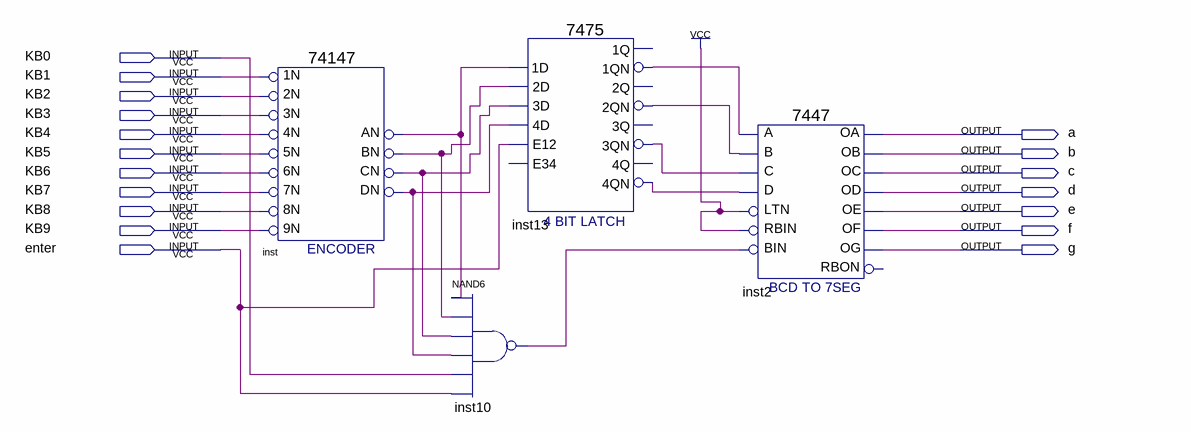
[diagram p0: schematic sheet]
// Quartus schematic circuitosSecuritybox2.bdf as structural Verilog: 4 symbols, 18 pins
module circuitosSecuritybox2 (
  input  KB0,
  input  KB1,
  input  KB2,
  input  KB3,
  input  KB4,
  input  KB5,
  input  KB6,
  input  KB7,
  input  KB8,
  input  KB9,
  input  enter,
  output a,
  output b,
  output c,
  output d,
  output e,
  output f,
  output g
);

  wire inst10_out, inst13_1qn, inst13_2qn, inst13_3qn, inst13_4qn, inst_an, inst_bn, inst_cn, inst_dn;

  \74147  inst (
    .\1N (KB1), .\2N (KB2), .\3N (KB3), .\6N (KB6), .\5N (KB5), .\4N (KB4), .\9N (KB9), .\8N (KB8),
    .\7N (KB7), .CN(inst_cn), .BN(inst_bn), .AN(inst_an), .DN(inst_dn));
  nand inst10 (inst10_out, inst_an, inst_bn, inst_cn, inst_dn, KB0, enter);
  \7475  inst13 (
    .E12(enter), .\3D (inst_cn), .\4D (inst_dn), .\2D (inst_bn), .\1D (inst_an), .\1QN (inst13_1qn),
    .\3QN (inst13_3qn), .\4QN (inst13_4qn), .\2QN (inst13_2qn));  // open: E34, 1Q, 2Q, 3Q, 4Q
  \7447  inst2 (
    .LTN(1'b1), .B(inst13_2qn), .C(inst13_3qn), .D(inst13_4qn), .RBIN(1'b1), .BIN(inst10_out),
    .A(inst13_1qn), .OB(b), .OC(c), .OE(e), .OD(d), .OF(f), .OG(g), .OA(a));  // open: RBON
endmodule
